# EAGLE schematic PP-Rev2 (EAGLE 6.5.0)
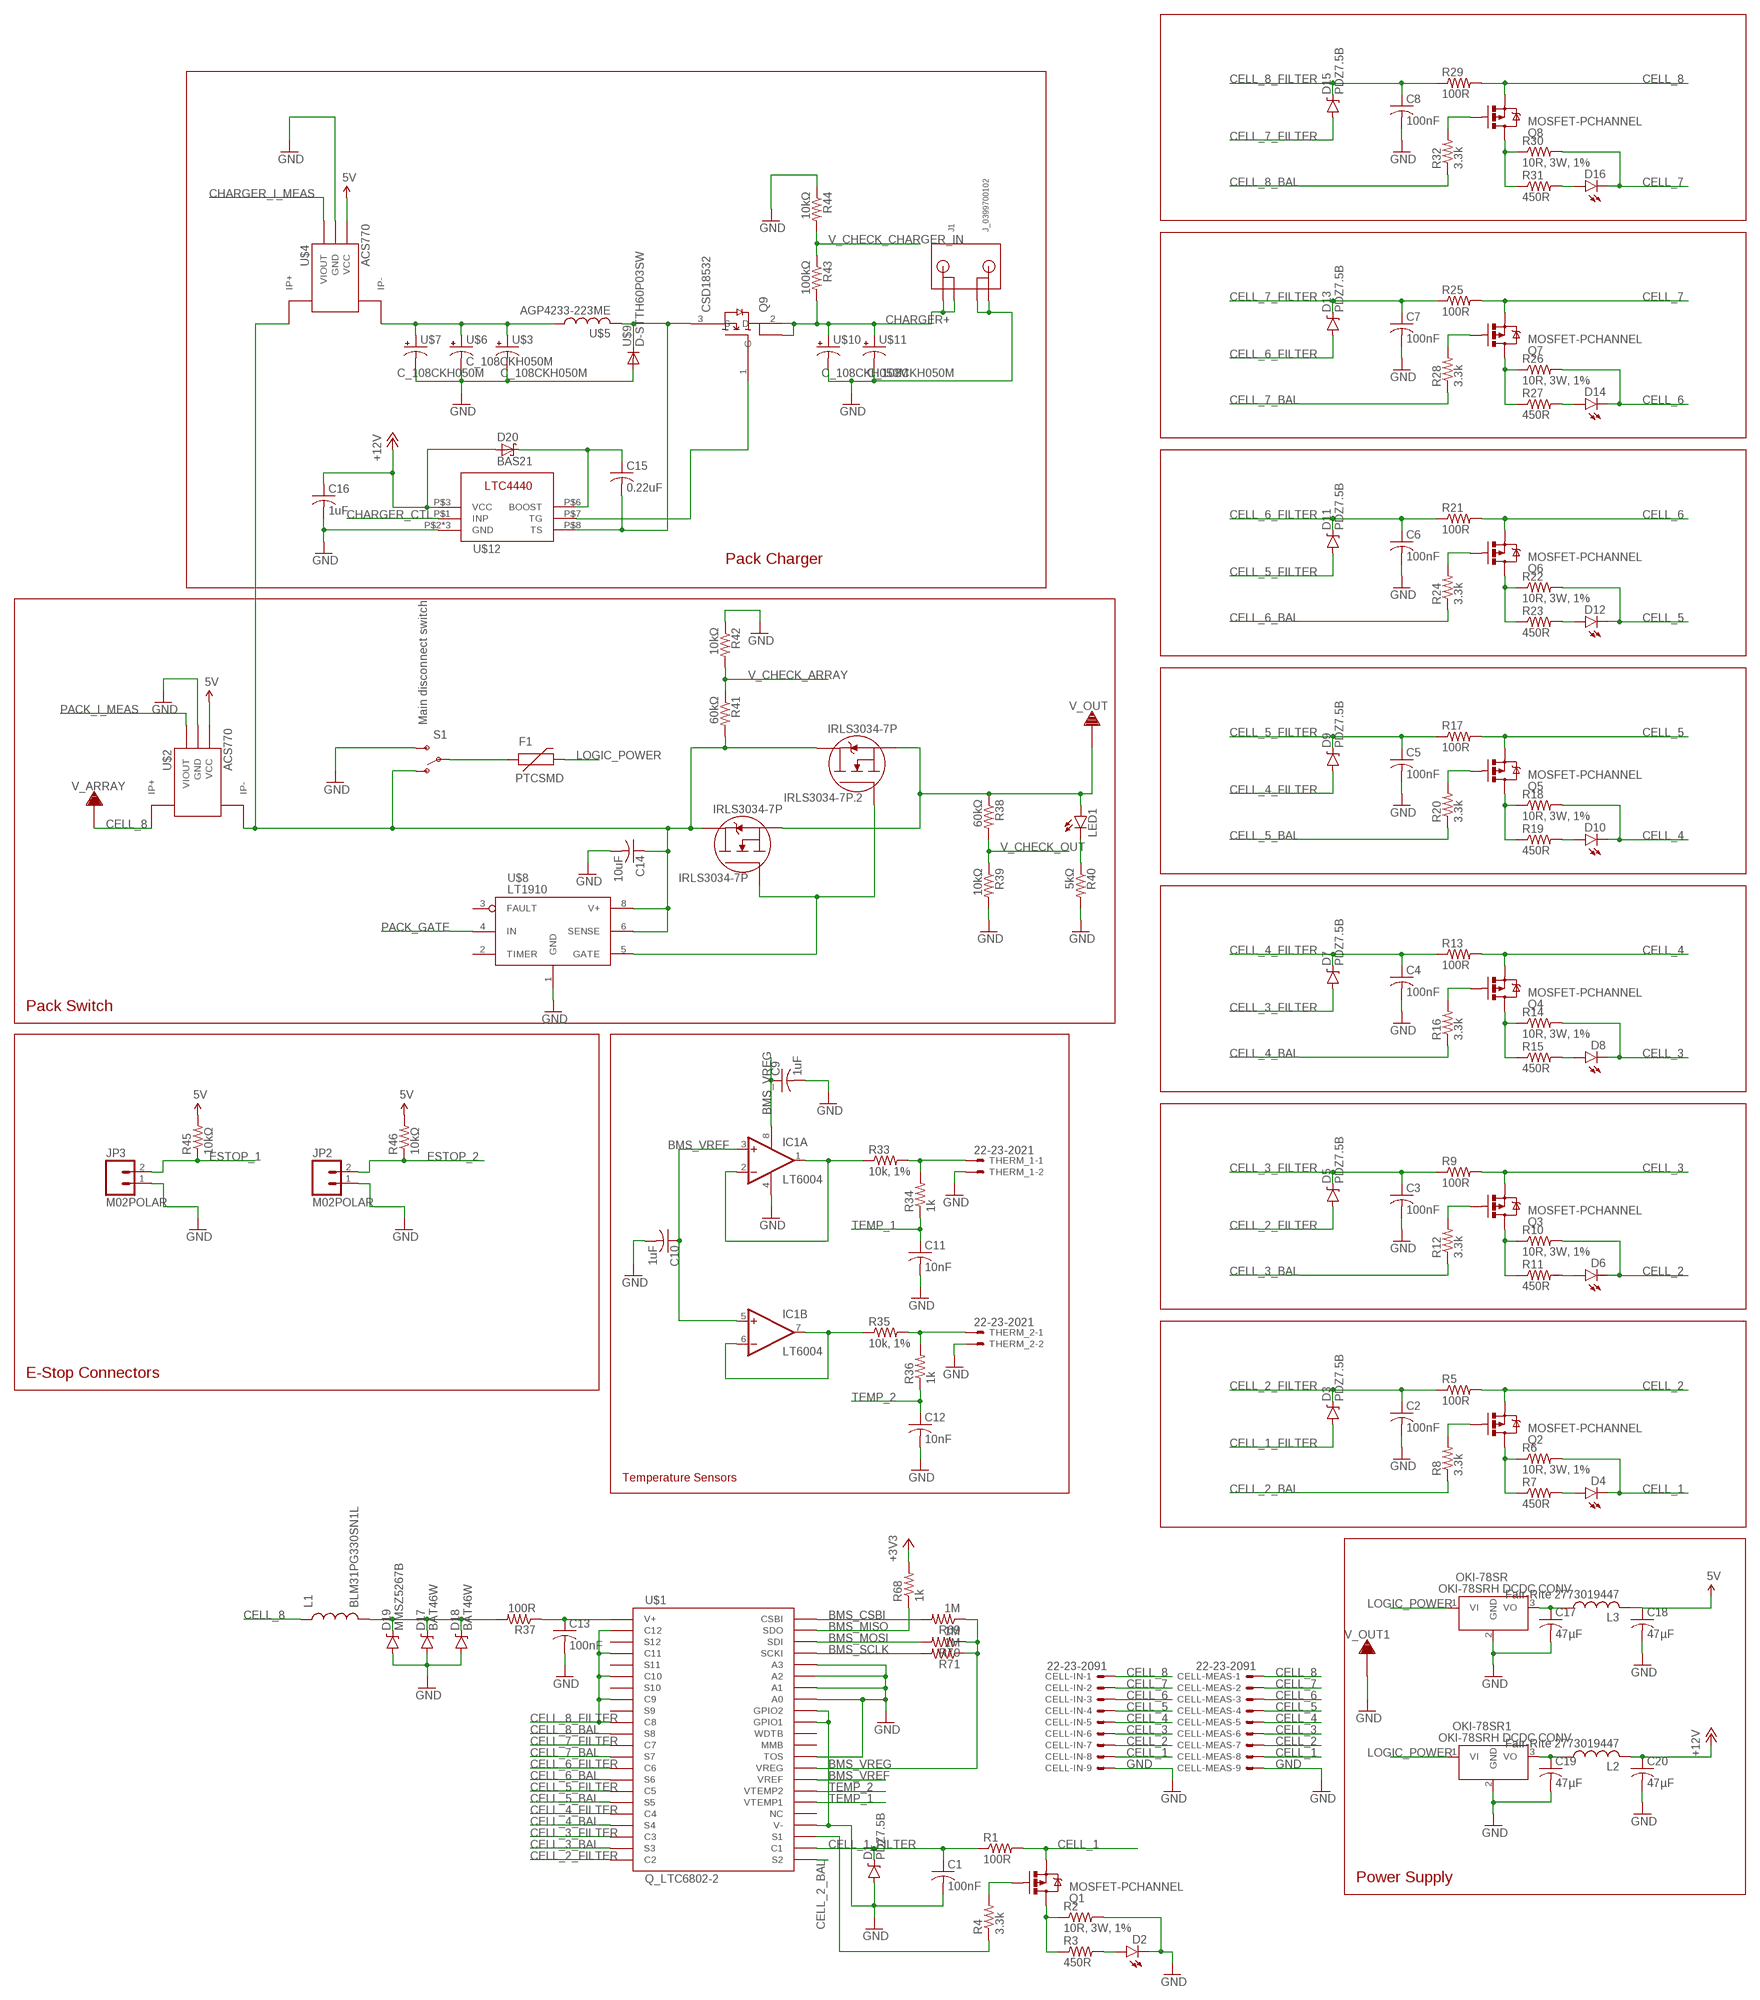
[diagram p0: schematic, sheet 1, part 1 of 2]
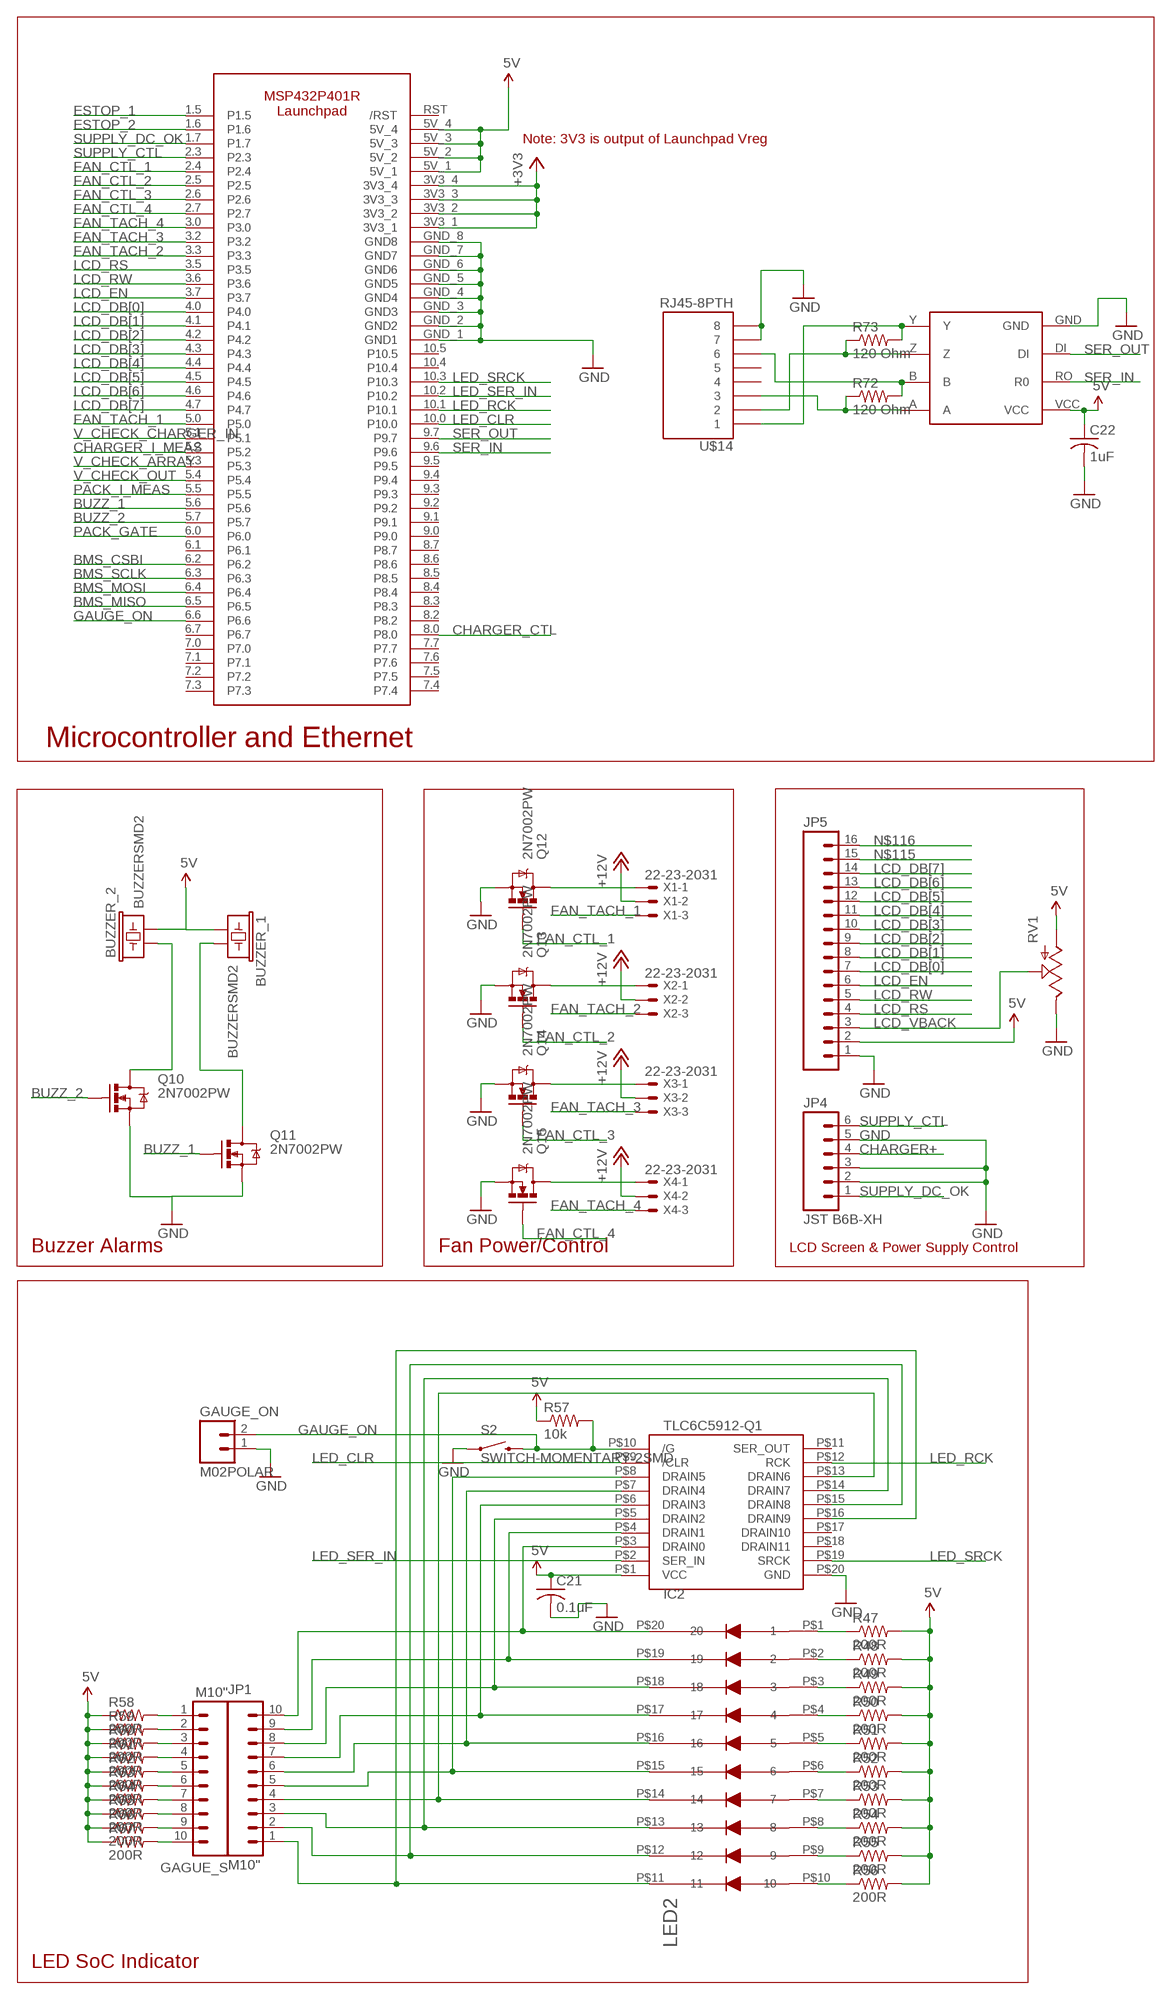
[diagram p1: schematic, sheet 1, part 2 of 2]

## Parts
BUZZER_1  BUZZERSMD2  [BUZZER-CCV]
BUZZER_2  BUZZERSMD2  [BUZZER-CCV]
C1  100nF  C-USC1206  [C1206]
C2  100nF  C-USC1206  [C1206]
C3  100nF  C-USC1206  [C1206]
C4  100nF  C-USC1206  [C1206]
C5  100nF  C-USC1206  [C1206]
C6  100nF  C-USC1206  [C1206]
C7  100nF  C-USC1206  [C1206]
C8  100nF  C-USC1206  [C1206]
C9  1uF  C-USC1206  [C1206]
C10  1uF  C-USC1206  [C1206]
C11  10nF  C-USC1206  [C1206]
C12  10nF  C-USC1206  [C1206]
C13  100nF  C-USC1206  [C1206]
C14  10uF  C-USC1206  [C1206]
C15  0.22uF  C-USC1206  [C1206]
C16  1uF  C-USC1206  [C1206]
C17  47µF  C-USC1206  [C1206]
C18  47µF  C-USC1206  [C1206]
C19  47µF  C-USC1206  [C1206]
C20  47µF  C-USC1206  [C1206]
C21  0.1uF  C-USC1206  [C1206]
C22  1uF  C-USC1206  [C1206]
CELL-IN  22-23-2091  [22-23-2091]
CELL-MEAS  22-23-2091  [22-23-2091]
D1  PDZ7.5B  DIODE-ZENER5.6V  [SOD-323]
D2  LED1206  [LED-1206]
D3  PDZ7.5B  DIODE-ZENER5.6V  [SOD-323]
D4  LED1206  [LED-1206]
D5  PDZ7.5B  DIODE-ZENER5.6V  [SOD-323]
D6  LED1206  [LED-1206]
D7  PDZ7.5B  DIODE-ZENER5.6V  [SOD-323]
D8  LED1206  [LED-1206]
D9  PDZ7.5B  DIODE-ZENER5.6V  [SOD-323]
D10  LED1206  [LED-1206]
D11  PDZ7.5B  DIODE-ZENER5.6V  [SOD-323]
D12  LED1206  [LED-1206]
D13  PDZ7.5B  DIODE-ZENER5.6V  [SOD-323]
D14  LED1206  [LED-1206]
D15  PDZ7.5B  DIODE-ZENER5.6V  [SOD-323]
D16  LED1206  [LED-1206]
D17  BAT46W  DIODE-ZENER16V  [SOD-123]
D18  BAT46W  DIODE-ZENER16V  [SOD-123]
D19  MMSZ5267B  DIODE-ZENER16V  [SOD-123]
D20  BAS21  BAS40  [SOT23]
F1  PTCSMD  [PTC-1206]
GAGUE_S  M10"  [1X10]
GAUGE_ON  M02POLAR  [MOLEX-1X2]
IC1  LT6004  OPA2345E  [MSOP08]
IC2  TLC6C5912-Q1  [SOIC-20]
IRLS3034-7P  IRLS3034-7P  [D2PAK-7]
IRLS3034-7P.2  IRLS3034-7P  [D2PAK-7]
J1  J_0399700102  [J_2CONHC]
JP1  M10"  [1X10]
JP2  M02POLAR  [MOLEX-1X2]
JP3  M02POLAR  [MOLEX-1X2]
JP4  JST B6B-XH  M06POLAR  [MOLEX-1X6]
JP5  M16LONGPADS  [1X16_LONGPADS]
L1  BLM31PG330SN1L  INDUCTOR1210  [1210]
L2  Fair-Rite 2773019447  L-USL8530M  [L8530M]
L3  Fair-Rite 2773019447  L-USL8530M  [L8530M]
LED1  LED1206  [LED-1206]
LED2  LED-DC7G3HWA  [LED-10]
OKI-78SR  Q_OKI-78SR5  Q_OKI-78SR  [OKI-78SRH]
OKI-78SR1  Q_OKI-78SR12  Q_OKI-78SR  [OKI-78SRH]
Q1  MOSFET-PCHANNEL  [SOT23-3]
Q2  MOSFET-PCHANNEL  [SOT23-3]
Q3  MOSFET-PCHANNEL  [SOT23-3]
Q4  MOSFET-PCHANNEL  [SOT23-3]
Q5  MOSFET-PCHANNEL  [SOT23-3]
Q6  MOSFET-PCHANNEL  [SOT23-3]
Q7  MOSFET-PCHANNEL  [SOT23-3]
Q8  MOSFET-PCHANNEL  [SOT23-3]
Q9  CSD18532  Q_CSD18532KCSPCB  [TO-220-FLAT]
Q10  2N7002PW  MOSFET-NCHANNEL2N7002PW  [SOT323]
Q11  2N7002PW  MOSFET-NCHANNEL2N7002PW  [SOT323]
Q12  2N7002PW  MOSFET-NCHANNEL2N7002PW  [SOT323]
Q13  2N7002PW  MOSFET-NCHANNEL2N7002PW  [SOT323]
Q14  2N7002PW  MOSFET-NCHANNEL2N7002PW  [SOT323]
Q15  2N7002PW  MOSFET-NCHANNEL2N7002PW  [SOT323]
R1  100R  R-US_R1206  [R1206]
R2  10R, 3W, 1%  RESISTORPTH-1W  [AXIAL-0.6]
R3  450R  RESISTOR1206  [1206]
R4  3.3k  RESISTOR1206  [1206]
R5  100R  R-US_R1206  [R1206]
R6  10R, 3W, 1%  RESISTORPTH-1W  [AXIAL-0.6]
R7  450R  RESISTOR1206  [1206]
R8  3.3k  RESISTOR1206  [1206]
R9  100R  R-US_R1206  [R1206]
R10  10R, 3W, 1%  RESISTORPTH-1W  [AXIAL-0.6]
R11  450R  RESISTOR1206  [1206]
R12  3.3k  RESISTOR1206  [1206]
R13  100R  R-US_R1206  [R1206]
R14  10R, 3W, 1%  RESISTORPTH-1W  [AXIAL-0.6]
R15  450R  RESISTOR1206  [1206]
R16  3.3k  RESISTOR1206  [1206]
R17  100R  R-US_R1206  [R1206]
R18  10R, 3W, 1%  RESISTORPTH-1W  [AXIAL-0.6]
R19  450R  RESISTOR1206  [1206]
R20  3.3k  RESISTOR1206  [1206]
R21  100R  R-US_R1206  [R1206]
R22  10R, 3W, 1%  RESISTORPTH-1W  [AXIAL-0.6]
R23  450R  RESISTOR1206  [1206]
R24  3.3k  RESISTOR1206  [1206]
R25  100R  R-US_R1206  [R1206]
R26  10R, 3W, 1%  RESISTORPTH-1W  [AXIAL-0.6]
R27  450R  RESISTOR1206  [1206]
R28  3.3k  RESISTOR1206  [1206]
R29  100R  R-US_R1206  [R1206]
R30  10R, 3W, 1%  RESISTORPTH-1W  [AXIAL-0.6]
R31  450R  RESISTOR1206  [1206]
R32  3.3k  RESISTOR1206  [1206]
R33  10k, 1%  R-US_R1206  [R1206]
R34  1k  R-US_R1206  [R1206]
R35  10k, 1%  R-US_R1206  [R1206]
R36  1k  R-US_R1206  [R1206]
R37  100R  R-US_R1206  [R1206]
R38  60kΩ  R-US_R1206  [R1206]
R39  10kΩ  R-US_R1206  [R1206]
R40  5kΩ  R-US_R1206  [R1206]
R41  60kΩ  R-US_R1206  [R1206]
R42  10kΩ  R-US_R1206  [R1206]
R43  100kΩ  R-US_R1206  [R1206]
R44  10kΩ  R-US_R1206  [R1206]
R45  10kΩ  R-US_R1206  [R1206]
R46  10kΩ  R-US_R1206  [R1206]
R47  200R  R-US_R1206  [R1206]
R48  200R  R-US_R1206  [R1206]
R49  200R  R-US_R1206  [R1206]
R50  200R  R-US_R1206  [R1206]
R51  200R  R-US_R1206  [R1206]
R52  200R  R-US_R1206  [R1206]
R53  200R  R-US_R1206  [R1206]
R54  200R  R-US_R1206  [R1206]
R55  200R  R-US_R1206  [R1206]
R56  200R  R-US_R1206  [R1206]
R57  10k  R-US_R1206  [R1206]
R58  200R  R-US_R1206  [R1206]
R59  200R  R-US_R1206  [R1206]
R60  200R  R-US_R1206  [R1206]
R61  200R  R-US_R1206  [R1206]
R62  200R  R-US_R1206  [R1206]
R63  200R  R-US_R1206  [R1206]
R64  200R  R-US_R1206  [R1206]
R65  200R  R-US_R1206  [R1206]
R66  200R  R-US_R1206  [R1206]
R67  200R  R-US_R1206  [R1206]
R68  1k  R-US_R1206  [R1206]
R69  1M  R-US_R1206  [R1206]
R70  1M  R-US_R1206  [R1206]
R71  1M  R-US_R1206  [R1206]
R72  120 Ohm  RESISTOR1206  [1206]
R73  120 Ohm  RESISTOR1206  [1206]
RV1  POTTRIM  [TRIM_POT]
S1  SWITCH-SPDTPTH  [SWITCH-SPDT]
S2  SWITCH-MOMENTARY-2SMD  [TACTILE-SWITCH-SMD]
THERM_1  22-23-2021  [22-23-2021]
THERM_2  22-23-2021  [22-23-2021]
U$1  Q_LTC6802-2  [SSOP44]
U$2  ACS770  [PFF_LEADFORM]
U$3  C_108CKH050M  [C_16MM]
U$4  ACS770  [PFF_LEADFORM]
U$5  AGP4233-223ME  AGP4233  [AGP4233]
U$6  C_108CKH050M  [C_16MM]
U$7  C_108CKH050M  [C_16MM]
U$8  LT1910  [SO8]
U$9  D-STTH60P03SW  [TO-247-VERT]
U$10  C_108CKH050M  [C_16MM]
U$11  C_108CKH050M  [C_16MM]
U$12  LTC4440  [MS8E]
U$13  MSP432P401R-LAUNCHPAD  [MSP432P401R-LAUNCHPAD]
U$14  RJ45-8PTH  [RJ45-8]
U$15  MAX3077  [MAX3070E]
V_ARRAY  TERMINAL_HOLE  [LARGE_TERMINAL_HOLE]
V_OUT  TERMINAL_HOLE  [LARGE_TERMINAL_HOLE]
V_OUT1  TERMINAL_HOLE  [LARGE_TERMINAL_HOLE]
X1  22-23-2031  [22-23-2031]
X2  22-23-2031  [22-23-2031]
X3  22-23-2031  [22-23-2031]
X4  22-23-2031  [22-23-2031]

## Nets
5V: BUZZER_1.+ BUZZER_2.- C18.1 C21.1 C22.1 IC2.P$1(VCC) JP5.2 L3.2 R45.2 R46.2 R47.2 R48.2 R49.2 R50.2 R51.2 R52.2 R53.2 R54.2 R55.2 R56.2 R57.1 R58.1 R59.1 R60.1 R61.1 R62.1 R63.1 R64.1 R65.1 R66.1 R67.1 RV1.3(A) U$2.1(VCC) U$4.1(VCC) U$13.5V_1 U$13.5V_2 U$13.5V_3 U$13.5V_4 U$15.VCC
+3V3: R68.2 U$13.3V3_1 U$13.3V3_2 U$13.3V3_3 U$13.3V3_4
+12V: C16.1 C20.1 D20.1(A) L2.2 U$12.P$3(VCC) X1.2 X2.2 X3.2 X4.2
BMS_CSBI: R69.2 U$1.44(CSBI) U$13.6.2
BMS_MISO: R68.1 U$1.43(SDO) U$13.6.5
BMS_MOSI: R70.2 U$1.42(SDI) U$13.6.4
BMS_SCLK: R71.2 U$1.41(SCKI) U$13.6.3
BMS_VREF: C10.1 IC1.3(A:+IN) IC1.5(B:+IN) U$1.30(VREF)
BMS_VREG: C9.1 IC1.8(A:V+) R69.1 R70.1 R71.1 U$1.31(VREG)
BUZZ_1: Q11.1(G) U$13.5.6
BUZZ_2: Q10.1(G) U$13.5.7
CELL_1: CELL-IN.8 CELL-MEAS.8 D4.C Q1.2(S) R1.2 R6.P$2
CELL_1_BAL: R4.1 U$1.25(S1)
CELL_1_FILTER: C1.1 D1.C D3.A R1.1 U$1.24(C1)
CELL_2: CELL-IN.7 CELL-MEAS.7 D6.C Q2.2(S) R5.2 R10.P$2
CELL_2_BAL: R8.1 U$1.23(S2)
CELL_2_FILTER: C2.1 D3.C D5.A R5.1 U$1.22(C2)
CELL_3: CELL-IN.6 CELL-MEAS.6 D8.C Q3.2(S) R9.2 R14.P$2
CELL_3_BAL: R12.1 U$1.21(S3)
CELL_3_FILTER: C3.1 D5.C D7.A R9.1 U$1.20(C3)
CELL_4: CELL-IN.5 CELL-MEAS.5 D10.C Q4.2(S) R13.2 R18.P$2
CELL_4_BAL: R16.1 U$1.19(S4)
CELL_4_FILTER: C4.1 D7.C D9.A R13.1 U$1.18(C4)
CELL_5: CELL-IN.4 CELL-MEAS.4 D12.C Q5.2(S) R17.2 R22.P$2
CELL_5_BAL: R20.1 U$1.17(S5)
CELL_5_FILTER: C5.1 D9.C D11.A R17.1 U$1.16(C5)
CELL_6: CELL-IN.3 CELL-MEAS.3 D14.C Q6.2(S) R21.2 R26.P$2
CELL_6_BAL: R24.1 U$1.15(S6)
CELL_6_FILTER: C6.1 D11.C D13.A R21.1 U$1.14(C6)
CELL_7: CELL-IN.2 CELL-MEAS.2 D16.C Q7.2(S) R25.2 R30.P$2
CELL_7_BAL: R28.1 U$1.13(S7)
CELL_7_FILTER: C7.1 D13.C D15.A R25.1 U$1.12(C7)
CELL_8: CELL-IN.1 CELL-MEAS.1 L1.1 Q8.2(S) R29.2 U$2.4_1(IP+) U$2.4_2(IP+) U$2.4_3(IP+) U$2.4_4(IP+) U$2.4_5(IP+) U$2.4_6(IP+) U$2.4_7(IP+) U$2.4_8(IP+) U$2.4_9(IP+) U$2.4_10(IP+) U$2.4_11(IP+) U$2.4_12(IP+) U$2.4_13(IP+) U$2.4_14(IP+) U$2.4_15(IP+) U$2.4_16(IP+) U$2.4_B(IP+) U$2.4_T(IP+) V_ARRAY.P$1
CELL_8_BAL: R32.1 U$1.11(S8)
CELL_8_FILTER: C8.1 D15.C R29.1 U$1.2(C12) U$1.4(C11) U$1.6(C10) U$1.8(C9) U$1.10(C8)
CHARGER+: J1.PIN1-1(1-1) J1.PIN1-2(1-2) JP4.4 Q9.2(D) Q9.4 R43.2 U$10.+ U$11.+
CHARGER_CTL: U$12.P$1(INP) U$13.8.0
CHARGER_I_MEAS: U$4.3(VIOUT) U$13.5.2
ESTOP_1: JP3.2 R45.1 U$13.1.5
ESTOP_2: JP2.2 R46.1 U$13.1.6
FAN_CTL_1: Q12.1(G) U$13.2.4
FAN_CTL_2: Q13.1(G) U$13.2.5
FAN_CTL_3: Q14.1(G) U$13.2.6
FAN_CTL_4: Q15.1(G) U$13.2.7
FAN_TACH_1: U$13.5.0 X1.3
FAN_TACH_2: U$13.3.3 X2.3
FAN_TACH_3: U$13.3.2 X3.3
FAN_TACH_4: U$13.3.0 X4.3
GAUGE_D: IC2.P$6(DRAIN3) JP1.7 LED2.P$17
GAUGE_ON: GAUGE_ON.2 IC2.P$10(/G) R57.2 S2.3 U$13.6.6
GND: C1.2 C2.2 C3.2 C4.2 C5.2 C6.2 C7.2 C8.2 C9.2 C10.2 C11.2 C12.2 C13.2 C14.2 C16.2 C17.2 C18.2 C19.2 C20.2 C21.2 C22.2 CELL-IN.9 CELL-MEAS.9 D1.A D2.C D17.A D18.A D19.A GAUGE_ON.1 IC1.4(A:V-) IC2.P$20(GND) J1.PIN2-1(2-1) J1.PIN2-2(2-2) JP2.1 JP3.1 JP4.2 JP4.3 JP4.5 JP5.1 OKI-78SR1.2(GND) OKI-78SR.2(GND) Q10.2(S) Q11.2(S) Q12.2(S) Q13.2(S) Q14.2(S) Q15.2(S) R2.P$2 R39.2 R40.2 R42.1 R44.1 RV1.2(E) S1.3(S) S2.1 THERM_1.2 THERM_2.2 U$1.26(V-) U$1.32(TOS) U$1.35(GPIO1) U$1.36(GPIO2) U$1.37(A0) U$1.38(A1) U$1.39(A2) U$1.40(A3) U$2.2(GND) U$3.GND(-) U$4.2(GND) U$6.GND(-) U$7.GND(-) U$8.1(GND) U$9.P$1(A) U$9.P$3(A) U$10.GND(-) U$11.GND(-) U$12.P$2(GND) U$12.P$4(GND) U$12.P$9(GND) U$13.GND_1(GND1) U$13.GND_2(GND2) U$13.GND_3(GND3) U$13.GND_4(GND4) U$13.GND_5(GND5) U$13.GND_6(GND6) U$13.GND_7(GND7) U$13.GND_8(GND8) U$14.7 U$14.8 U$15.GND V_OUT1.P$1
LCD_DB[0]: JP5.7 U$13.4.0
LCD_DB[1]: JP5.8 U$13.4.1
LCD_DB[2]: JP5.9 U$13.4.2
LCD_DB[3]: JP5.10 U$13.4.3
LCD_DB[4]: JP5.11 U$13.4.4
LCD_DB[5]: JP5.12 U$13.4.5
LCD_DB[6]: JP5.13 U$13.4.6
LCD_DB[7]: JP5.14 U$13.4.7
LCD_EN: JP5.6 U$13.3.7
LCD_RS: JP5.4 U$13.3.5
LCD_RW: JP5.5 U$13.3.6
LCD_VBACK: JP5.3 RV1.1(S)
LED_CLR: IC2.P$9(/CLR) U$13.10.0
LED_RCK: IC2.P$12(RCK) U$13.10.1
LED_SER_IN: IC2.P$2(SER_IN) U$13.10.2
LED_SRCK: IC2.P$19(SRCK) U$13.10.3
LOGIC_POWER: F1.2 OKI-78SR1.1(VI) OKI-78SR.1(VI)
N$1: Q3.3(D) R10.P$1 R11.1
N$2: Q1.3(D) R2.P$1 R3.1
N$3: D2.A R3.2
N$4: D6.A R11.2
N$5: Q1.1(G) R4.2
N$6: Q3.1(G) R12.2
N$7: Q2.3(D) R6.P$1 R7.1
N$8: D4.A R7.2
N$9: Q2.1(G) R8.2
N$10: Q4.3(D) R14.P$1 R15.1
N$11: D8.A R15.2
N$12: Q4.1(G) R16.2
N$13: Q5.3(D) R18.P$1 R19.1
N$14: D10.A R19.2
N$15: Q5.1(G) R20.2
N$16: Q6.3(D) R22.P$1 R23.1
N$17: D12.A R23.2
N$18: Q6.1(G) R24.2
N$19: Q7.3(D) R26.P$1 R27.1
N$20: D14.A R27.2
N$21: Q7.1(G) R28.2
N$22: Q8.3(D) R30.P$1 R31.1
N$23: D16.A R31.2
N$24: Q8.1(G) R32.2
N$25: IC1.1(A:OUT) IC1.2(A:-IN) R33.1
N$26: D17.C D18.C D19.C L1.2 R37.2
N$27: IC1.6(B:-IN) IC1.7(B:OUT) R35.1
N$28: U$3.+ U$4.5_1(IP-) U$4.5_2(IP-) U$4.5_3(IP-) U$4.5_4(IP-) U$4.5_5(IP-) U$4.5_6(IP-) U$4.5_7(IP-) U$4.5_8(IP-) U$4.5_9(IP-) U$4.5_10(IP-) U$4.5_11(IP-) U$4.5_12(IP-) U$4.5_13(IP-) U$4.5_14(IP-) U$4.5_15(IP-) U$4.5_16(IP-) U$4.5_B(IP-) U$4.5_T(IP-) U$5.P$1 U$6.+ U$7.+
N$29: R33.2 R34.2 THERM_1.1
N$30: R35.2 R36.2 THERM_2.1
N$31: C13.1 R37.1 U$1.1(V+)
N$32: IC2.P$3(DRAIN0) JP1.10 LED2.P$20
N$33: C19.1 L2.1 OKI-78SR1.3(VO)
N$34: IRLS3034-7P.1(GATE) IRLS3034-7P.2.1(GATE) U$8.5(GATE)
N$35: R73.2 U$14.1 U$15.Y
N$36: LED1.C R40.1
N$37: IRLS3034-7P.2(SOURCE) IRLS3034-7P.2.2(SOURCE) IRLS3034-7P.2.3(SOURCE) IRLS3034-7P.2.4(SOURCE) IRLS3034-7P.2.5(SOURCE) IRLS3034-7P.2.6(SOURCE) IRLS3034-7P.3(SOURCE) IRLS3034-7P.4(SOURCE) IRLS3034-7P.5(SOURCE) IRLS3034-7P.6(SOURCE) LED1.A R38.1 V_OUT.P$1
N$38: C15.1 D20.3(C) U$12.P$6(BOOST)
N$39: C15.2 Q9.3(S) U$5.P$2 U$9.P$2(C) U$12.P$8(TS)
N$40: Q9.1(G) U$12.P$7(TG)
N$41: C14.1 IRLS3034-7P.2.PAD(DRAIN) IRLS3034-7P.PAD(DRAIN) R41.2 S1.1(O) U$2.5_1(IP-) U$2.5_2(IP-) U$2.5_3(IP-) U$2.5_4(IP-) U$2.5_5(IP-) U$2.5_6(IP-) U$2.5_7(IP-) U$2.5_8(IP-) U$2.5_9(IP-) U$2.5_10(IP-) U$2.5_11(IP-) U$2.5_12(IP-) U$2.5_13(IP-) U$2.5_14(IP-) U$2.5_15(IP-) U$2.5_16(IP-) U$2.5_B(IP-) U$2.5_T(IP-) U$4.4_1(IP+) U$4.4_2(IP+) U$4.4_3(IP+) U$4.4_4(IP+) U$4.4_5(IP+) U$4.4_6(IP+) U$4.4_7(IP+) U$4.4_8(IP+) U$4.4_9(IP+) U$4.4_10(IP+) U$4.4_11(IP+) U$4.4_12(IP+) U$4.4_13(IP+) U$4.4_14(IP+) U$4.4_15(IP+) U$4.4_16(IP+) U$4.4_B(IP+) U$4.4_T(IP+) U$8.6(SENSE) U$8.8(V+)
N$42: F1.1 S1.2(P)
N$43: IC2.P$4(DRAIN1) JP1.9 LED2.P$19
N$44: IC2.P$5(DRAIN2) JP1.8 LED2.P$18
N$45: R73.1 U$14.2 U$15.Z
N$46: IC2.P$7(DRAIN4) JP1.6 LED2.P$16
N$47: IC2.P$8(DRAIN5) JP1.5 LED2.P$15
N$48: IC2.P$13(DRAIN6) JP1.4 LED2.P$14
N$49: IC2.P$14(DRAIN7) JP1.3 LED2.P$13
N$50: IC2.P$15(DRAIN8) JP1.2 LED2.P$12
N$51: IC2.P$16(DRAIN9) JP1.1 LED2.P$11
N$52: LED2.P$1 R47.1
N$53: LED2.P$2 R48.1
N$54: LED2.P$3 R49.1
N$55: LED2.P$4 R50.1
N$56: LED2.P$5 R51.1
N$57: LED2.P$6 R52.1
N$58: LED2.P$7 R53.1
N$59: LED2.P$8 R54.1
N$60: LED2.P$9 R55.1
N$61: LED2.P$10 R56.1
N$62: R72.2 U$14.6 U$15.B
N$63: BUZZER_1.- Q11.3(D)
N$64: BUZZER_2.+ Q10.3(D)
N$66: Q12.3(D) X1.1
N$67: R72.1 U$14.3 U$15.A
N$70: Q13.3(D) X2.1
N$71: Q14.3(D) X3.1
N$72: Q15.3(D) X4.1
N$75: GAGUE_S.1 R58.2
N$76: GAGUE_S.2 R59.2
N$77: GAGUE_S.3 R60.2
N$78: GAGUE_S.4 R61.2
N$79: GAGUE_S.5 R62.2
N$80: GAGUE_S.6 R63.2
N$81: GAGUE_S.7 R64.2
N$82: GAGUE_S.8 R65.2
N$83: GAGUE_S.9 R66.2
N$84: GAGUE_S.10 R67.2
N$100: C17.1 L3.1 OKI-78SR.3(VO)
N$115: JP5.15
N$116: JP5.16
PACK_GATE: U$8.4(IN) U$13.6.0
PACK_I_MEAS: U$2.3(VIOUT) U$13.5.5
SER_IN: U$13.9.6 U$15.RO(R0)
SER_OUT: U$13.9.7 U$15.DI
SUPPLY_CTL: JP4.6 U$13.2.3
SUPPLY_DC_OK: JP4.1 U$13.1.7
TEMP_1: C11.1 R34.1 U$1.28(VTEMP1)
TEMP_2: C12.1 R36.1 U$1.29(VTEMP2)
V_CHECK_ARRAY: R41.1 R42.2 U$13.5.3
V_CHECK_CHARGER_IN: R43.1 R44.2 U$13.5.1
V_CHECK_OUT: R38.2 R39.1 U$13.5.4
Unconnected: IC2.P$11(SER_OUT) IC2.P$17(DRAIN10) IC2.P$18(DRAIN11) U$1.3(S12) U$1.5(S11) U$1.7(S10) U$1.9(S9) U$1.27(NC) U$1.33(MMB) U$1.34(WDTB) U$8.2(TIMER) U$8.3(FAULT) U$13.6.1 U$13.6.7 U$13.7.0 U$13.7.1 U$13.7.2 U$13.7.3 U$13.7.4 U$13.7.5 U$13.7.6 U$13.7.7 U$13.8.2 U$13.8.3 U$13.8.4 U$13.8.5 U$13.8.6 U$13.8.7 U$13.9.0 U$13.9.1 U$13.9.2 U$13.9.3 U$13.9.4 U$13.9.5 U$13.10.4 U$13.10.5 U$13.RST(/RST) U$14.4 U$14.5

## Notes on the sheet
- Note: 3V3 is output of Launchpad Vreg
- Pack Charger
- Main disconnect switch
- Microcontroller and Ethernet
- Pack Switch
- Buzzer Alarms | Fan Power/Control | LCD Screen & Power Supply Control
- E-Stop Connectors
- Temperature Sensors
- Power Supply | LED SoC Indicator

## Library data of the parts
BUZZER_1 BUZZER_2 = SparkFun-Electromechanical:BUZZER: Buzzer 12mm Spark Fun Electronics SKU : Comp-Buzzer
C1-C16 = rcl:C-US: CAPACITOR, American symbol
C17-C22 = resistor:C-US: CAPACITOR, American symbol
CELL-IN CELL-MEAS = con-molex:22-23-2091: .100" (2.54mm) Center Header - 9 Pin; MF: MOLEX; MPN: 22-23-2091; OC_FARNELL: 1756827; OC_NEWARK: 56H0450
D1 D3 D5 D7 D9 D11 D13 D15 = SparkFun-DiscreteSemi:DIODE-ZENER: Zener Diode Production Part - 8199 3.4V Zener Voltage; PROD_ID: DIO-12442; VALUE: 5.6V
D2 D4 D6 D8 D10 D12 D14 D16 LED1 = SparkFun-LED:LED: LEDs Standard schematic elements and footprints for 5mm, 3mm, 1206, and 0603 sized LEDs. 5mm - Spark Fun Electronics SKU : COM-00529 (and others)
D17-D19 = SparkFun-DiscreteSemi:DIODE-ZENER: Zener Diode Production Part - 8199 3.4V Zener Voltage; PROD_ID: DIO-12440; VALUE: 16V
D20 = diode:BAS40: Silicon Schottky Diodes General-purpose diode for high-speed switching
F1 = SparkFun-PowerIC:PTC: Resettable Fuse PTC Resettable Fuse. Spark Fun Electronics SKU : COM-08357; PROD_ID: RES-11150
GAGUE_S JP1 = SparkFun-Connectors:M10: Header 10 Standard 10-pin 0.1" header. Use with straight break away headers (SKU : PRT-00116), right angle break away headers (PRT-00553), swiss pins (PRT-00743), machine pins (PRT-00117), and female headers (PRT-00115).
GAUGE_ON JP2 JP3 = SparkFun-Connectors:M02: Standard 2-pin 0.1" header. Use with - straight break away headers ( PRT-00116) - right angle break away headers (PRT-00553) - swiss pins (PRT-00743) - machine pins (PRT-00117) - female headers (PRT-00115) Molex polarized connector foot print use with: PRT-08233 with associated crimp pins and housings. 2.54_SCREWTERM for use with PRT-10571. 3.5mm Screw Terminal footprints for PRT-08084 5mm Screw Terminal footprints for use with PRT-08433
IC1 = linear:OPA2*: Dual Operational Amplifier Low Power, Single-Supply, Rail-To-Rail Operational Amplifier Source: http://focus.ti.com/lit/ds/symlink/opa2345.pdf http://focus.ti.com .. opa241.pdf http://focus.ti.com/lit/ds/symlink/opa2134.pdf
IC2 = 2016PowerPackLibraries:TLC6C5912-Q1
IRLS3034-7P IRLS3034-7P.2 = MRDT-2015-BMS:IRLS3034-7P: High-current SMD MOSFET
J1 = MRDT-2014-All:J_0399700102: High Current Power Connector
JP4 = SparkFun-Connectors:M06: Header 6 Standard 6-pin 0.1" header. Use with straight break away headers (SKU : PRT-00116), right angle break away headers (PRT-00553), swiss pins (PRT-00743), machine pins (PRT-00117), and female headers (PRT-00115). Molex polarized connector foot print use with SKU : PRT-08094 with associated crimp pins and housings. NOTES ON THE VARIANTS LOCK and LOCK_LONGPADS... This footprint was designed to help hold the alignment of a through-hole component (i.e. 6-pin header) while soldering it into place. You may notice that each hole has been shifted either up or down by 0.005 of an inch from it's more standard position (which is a perfectly straight line). This slight alteration caused the pins (the squares in the middle) to touch the edges of the holes. Because they are alternating, it causes a "brace" to hold the component in place. 0.005 has proven to be the perfect amount of "off-center" position when using our standard breakaway headers. Although looks a little odd when you look at the bare footprint, once you have a header in there, the alteration is very hard to notice. Also,if you push a header all the way into place, it is covered up entirely on the bottom side. This idea of altering the position of holes to aid alignment will be further integrated into the Sparkfun Library for other footprints. It can help hold any component with 3 or more connection pins.
JP5 = SparkFun-Connectors:M16: 1x16 .1" header
L1 = SparkFun-Passives:INDUCTOR: Inductors Basic Inductor/Choke - 0603 and 1206. Footprints are not proven and vary greatly between part numbers. INDUCTOR POWER 3.3UH 4.0A SMD 0.197" L x 0.197" W x 0.177" H (5.00mm x 5.00mm x 4.50mm)
L2 L3 = rcl:L-US: INDUCTOR, American symbol
LED2 = 2016PowerPackLibraries:LED-DC7G3HWA: 10 segement LED - Kingbright part # DC7G3HWA
OKI-78SR OKI-78SR1 = MRDT-2015-PowerBoard:Q_OKI-78SR: 4.95W DC/DC Converter Manufacturer: Murata Part Number: OKI-78SR-5/1.5-W36H-C OKI-78SR-3.3/1.5-W36H-C
Q1-Q8 = SparkFun-DiscreteSemi:MOSFET-PCHANNEL: Generic PMOSFET IRLML2244 - TRANS-11153 (SOT-23 -20V -4.3A) (1.Gate 2.Source 3.Drain) FQP27P06 - COM-10349 <http://www.sparkfun.com/products/10349> (TO-220 -60V -27A) (1.Gate 2.Source 3.Drain); PROD_ID: TRANS-08285
Q9 = PCB0M1:Q_CSD18532KCS: 60V 100A N Channel MOSFET
Q10-Q15 = SparkFun-DiscreteSemi:MOSFET-NCHANNEL: Common NMOSFET Parts MFG P/N Store ID Prod ID FDD8780 TRANS-09984 SI7820DN TRANS-11055 FDS6630A IC-08089 2N7002PW TRANS-11151 FQP30N06L COM-10213 TRANS-10060 BSS123LT1G TRANS-08345 BSS138 TRANS-00830 BS170 2N7000; PROD_ID: TRANS-11151
R1 R5 R9 R13 R17 R21 R25 R29 R33-R37 R47-R71 = rcl:R-US_: RESISTOR, American symbol
R2-R4 R6-R8 R10-R12 R14-R16 R18-R20 R22-R24 R26-R28 R30-R32 = SparkFun-Resistors:RESISTOR: Resistor Basic schematic elements and footprints for 0603, 1206, and PTH resistors.
R38-R46 = resistor:R-US_: RESISTOR, American symbol
R72 R73 = SparkFun-Passives:RESISTOR: Resistor Basic schematic elements and footprints for 0603, 1206, and PTH resistors.
RV1 = SparkFun-Electromechanical:POT
S1 = SparkFun-Electromechanical:SWITCH-SPDT: SPDT Switch Simple slide switch, Spark Fun Electronics SKU : COM-00102 DPDT SMT slide switch, AYZ0202, SWCH-08179
S2 = SparkFun-Electromechanical:SWITCH-MOMENTARY-2: Various NO switches- pushbuttons, reed, etc; PROD_ID: SWCH-08247
THERM_1 THERM_2 = con-molex:22-23-2021: .100" (2.54mm) Center Header - 2 Pin; MF: MOLEX; MPN: 22-23-2021; OC_FARNELL: 1462926; OC_NEWARK: 25C3832
U$1 = MRDT-2015-BMS:Q_LTC6802-2
U$2 U$4 = MRDT-2015-BMS:ACS770
U$3 U$6 U$7 U$10 U$11 = MRDT-2015-PowerBoard:C_108CKH050M: CAP ALUM 50V 0.1mF 1.1A ripple
U$5 = 2016PowerPackLibraries:AGP4233
U$8 = MRDT-2015-PowerBoard:LT1910
U$9 = 2016PowerPackLibraries:D-STTH60P03SW
U$12 = 2016PowerPackLibraries:LTC4440
U$13 = 2016PowerPackLibraries:MSP432P401R-LAUNCHPAD
U$14 = SparkFun-Connectors:RJ45-8: RJ45 Jack Simple RJ45, 8-pin connection - connector for common Cat5, Cat5e, and Cat6 Ethernet cables. Footprint not yet proven in production. Connector sku is PRT-00643; Breakout PCB sku is BOB-00716.
U$15 = MAX3077:MAX3077
V_ARRAY V_OUT V_OUT1 = MRDT-2015-PowerBoard:TERMINAL_HOLE
X1-X4 = con-molex:22-23-2031: .100" (2.54mm) Center Header - 3 Pin; MF: MOLEX; MPN: 22-23-2031; OC_FARNELL: 1462950; OC_NEWARK: 30C0862